# Altium schematic sheet PowerAndUSB.SchDoc
size A4; SheetNumber: 1; SheetTotal: 4
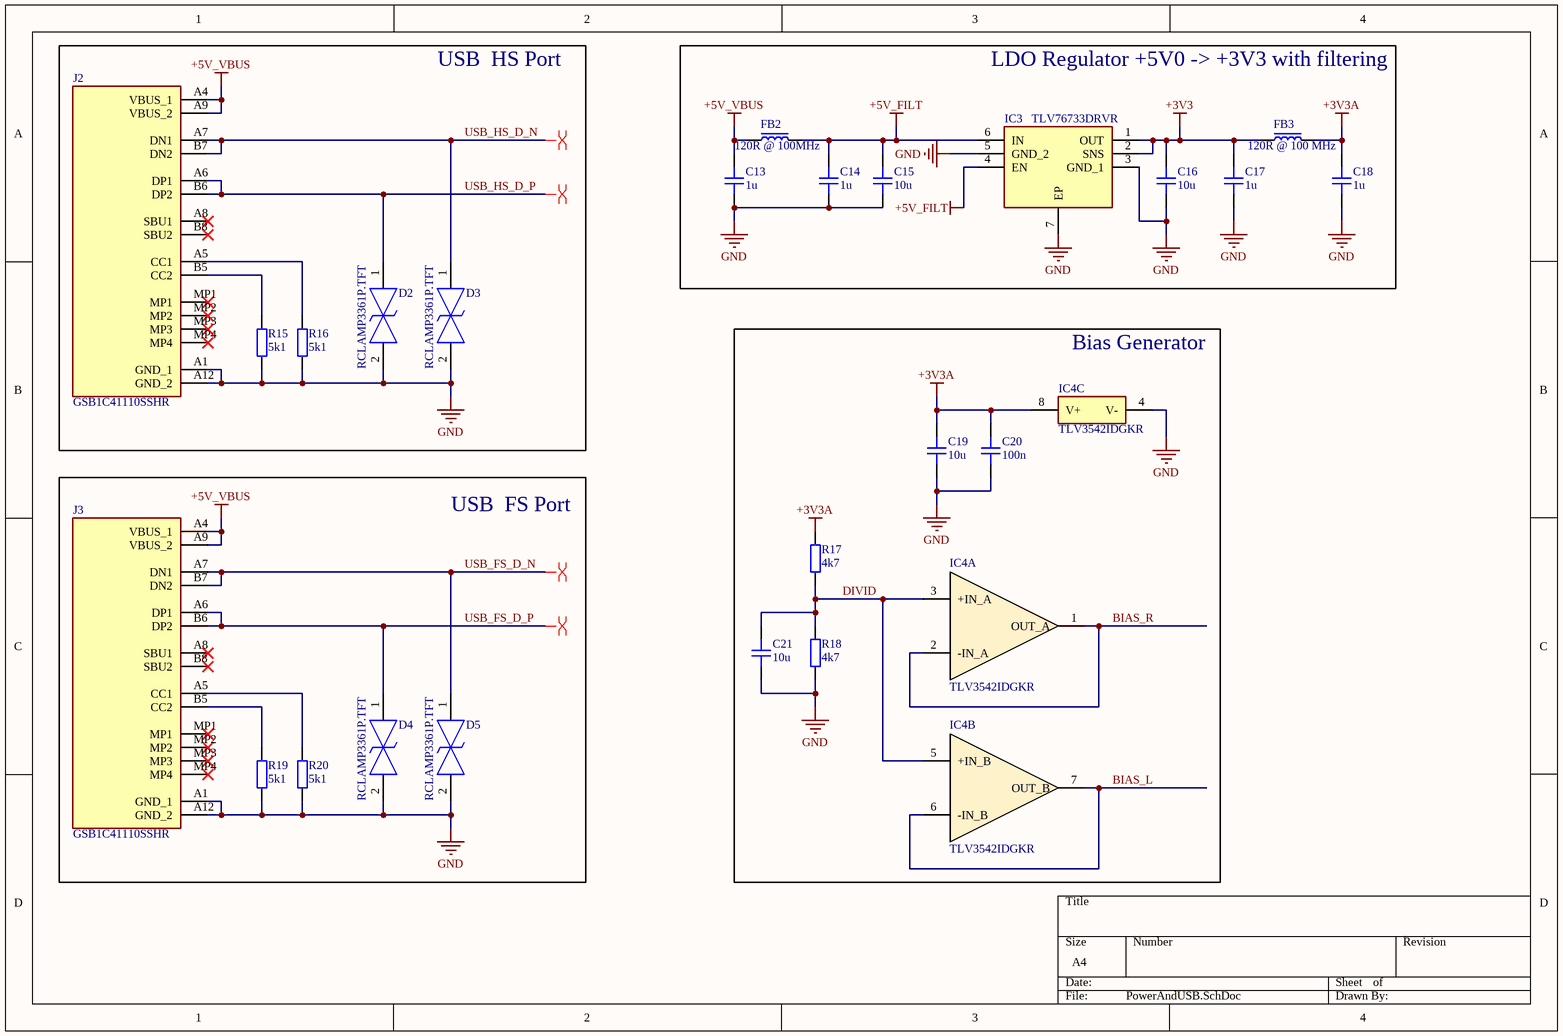
[diagram p0: PowerAndUSB.SchDoc]

## Parts
C13  1u  [CAP_0805]
C14  1u  [CAP_0805]
C15  10u  [CAP_0805]
C16  10u  [CAP_0805]
C17  1u  [CAP_0402]
C18  1u  [CAP_0402]
C19  10u  [CAP_0603]
C20  100n  [CAP_0402]
C21  10u  [CAP_0603]
D2  RCLAMP3361P.TFT  [RCLAMP3361PTFT]
D3  RCLAMP3361P.TFT  [RCLAMP3361PTFT]
D4  RCLAMP3361P.TFT  [RCLAMP3361PTFT]
D5  RCLAMP3361P.TFT  [RCLAMP3361PTFT]
FB2  120R @ 100MHz  [FB_0805]
FB3  120R @ 100 MHz  [FB_0603]
IC3  TLV76733DRVR  [SON65P200X200X80-7N]
IC4  TLV3542IDGKR  [SOP65P490X110-8N]  (parts A,B,C of 3)
J2  GSB1C41110SSHR  [GSB1C41110SSHR]
J3  GSB1C41110SSHR  [GSB1C41110SSHR]
R15  5k1  [RES_0402]
R16  5k1  [RES_0402]
R17  4k7  [RES_0603]
R18  4k7  [RES_0603]
R19  5k1  [RES_0402]
R20  5k1  [RES_0402]

## Blocks framed on the sheet
USB  HS Port: D2 D3 J2 R15 R16
LDO Regulator +5V0 -> +3V3 with filtering: C13-C18 FB2 FB3 IC3
Bias Generator: C19-C21 IC4 R17 R18
USB  FS Port: D4 D5 J3 R19 R20

## Nets
+3V3: C16.2 C17.1 FB3.1 IC3.1(OUT) IC3.2(SNS)
+3V3A: C18.1 C19.2 C20.2 FB3.2 IC4.8(V+) R17.2
+5V_FILT: C14.2 C15.2 FB2.2 IC3.4(EN) IC3.6(IN)
+5V_VBUS: C13.2 FB2.1 J2.A4(VBUS_1) J2.A9(VBUS_2) J3.A4(VBUS_1) J3.A9(VBUS_2)
GND: C13.1 C14.1 C15.1 C16.1 C17.2 C18.2 C19.1 C20.1 C21.1 D2.2 D3.2 D4.2 D5.2 IC3.3(GND_1) IC3.5(GND_2) IC3.7(EP) IC4.4(V-) J2.A1(GND_1) J2.A12(GND_2) J3.A1(GND_1) J3.A12(GND_2) R15.1 R16.1 R18.1 R19.1 R20.1
BIAS_L: IC4.6(-IN_B) IC4.7(OUT_B)
BIAS_R: IC4.1(OUT_A) IC4.2(-IN_A)
DIVID: C21.2 IC4.3(+IN_A) IC4.5(+IN_B) R17.1 R18.2
USB_FS_D_N: D5.1 J3.A7(DN1) J3.B7(DN2)
USB_FS_D_P: D4.1 J3.A6(DP1) J3.B6(DP2)
USB_HS_D_N: D3.1 J2.A7(DN1) J2.B7(DN2)
USB_HS_D_P: D2.1 J2.A6(DP1) J2.B6(DP2)
NetJ2_A5: J2.A5(CC1) R16.2
NetJ2_B5: J2.B5(CC2) R15.2
NetJ3_A5: J3.A5(CC1) R20.2
NetJ3_B5: J3.B5(CC2) R19.2

Not connected (* = marked no-connect by the designer): J2 A8(SBU1)* B8(SBU2)* MP1* MP2* MP3* MP4*; J3 A8(SBU1)* B8(SBU2)* MP1* MP2* MP3* MP4*

## Layout directives
differential pair: USB_FS_D_N, USB_FS_D_P, USB_HS_D_N, USB_HS_D_P

## Library data of the parts
C13-C16 = CAP_0805: Capacitor SMD 0805; Manufacturer: *; Manufacturer Part Number: *; Distributor Link: *; LCSC: *; Rating: *; Dielectric: *
C17 C18 C20 = CAP_0402: Capacitor SMD 0402; Manufacturer: *; Manufacturer Part Number: *; Distributor Link: *; LCSC: *; Rating: *; Dielectric: *
C19 C21 = CAP_0603: Capacitor SMD 0603; Manufacturer: *; Manufacturer Part Number: *; Distributor Link: *; LCSC: *; Rating: *; Dielectric: *
D2-D5 = RCLAMP3361P.TFT: TVS Diode (Bi-directional); Manufacturer_Name: SEMTECH; Datasheet Link: https://www.mouser.co.uk/datasheet/2/196/CYPR_S_A0000095755_1-3003525.pdf; Height: 0.53mm; Manufacturer_Part_Number: RCLAMP3361P.TFT
FB2 = FB_0805: Ferrite Bead SMD 0805; Manufacturer: *; Manufacturer Part Number: *; Distributor Link: *; LCSC: *
FB3 = FB_0603: Ferrite Bead SMD 0603; Manufacturer: *; Manufacturer Part Number: *; Distributor Link: *; LCSC: *
IC3 = TLV76733DRVR: Integrated Circuit; Manufacturer_Name: Texas Instruments; Datasheet Link: http://www.ti.com/lit/gpn/TLV767; Height: 0.8mm; Manufacturer_Part_Number: TLV76733DRVR; Mouser Part Number: 595-TLV76733DRVR; Mouser Price/Stock: https://www.mouser.co.uk/ProductDetail/Texas-Instruments/TLV76733DRVR?qs=9r4v7xj2LnmGIkwTuPlHig%3D%3D; Arrow Part Number: TLV76733DRVR; Arrow Price/Stock: https://www.arrow.com/en/products/tlv76733drvr/texas-instruments?region=nac
IC4 = TLV3542IDGKR: Integrated Circuit; Manufacturer_Name: Texas Instruments; Datasheet Link: http://www.ti.com/lit/gpn/tlv3542; Height: 1.1mm; Manufacturer_Part_Number: TLV3542IDGKR; Mouser Part Number: 595-TLV3542IDGKR; Mouser Price/Stock: https://www.mouser.co.uk/ProductDetail/Texas-Instruments/TLV3542IDGKR?qs=9lcNTSmDlCr5gl2sVJgJdw%3D%3D; Arrow Part Number: TLV3542IDGKR; Arrow Price/Stock: https://www.arrow.com/en/products/tlv3542idgkr/texas-instruments
J2 J3 = GSB1C41110SSHR: Connector; Manufacturer_Name: Amphenol Communications Solutions; Datasheet Link: https://cdn.amphenol-cs.com/media/wysiwyg/files/drawing/gsb1c41x10sshr-ax1.pdf; Height: 3.41mm; Manufacturer_Part_Number: GSB1C41110SSHR
R15 R16 R19 R20 = RES_0402: Resistor SMD 0402; Manufacturer: *; Manufacturer Part Number: *; Distributor Link: *; LCSC: *
R17 R18 = RES_0603: Resistor SMD 0603; Manufacturer: *; Manufacturer Part Number: *; Distributor Link: *; LCSC: *